# Altium schematic sheet 24D_USonicEcho_test.SchDoc
size A4
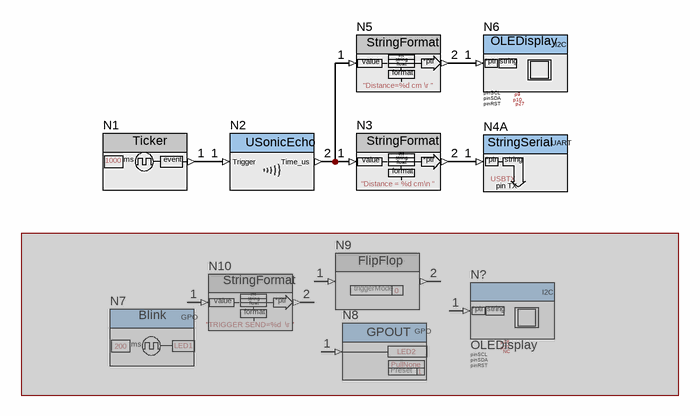
[diagram p0: 24D_USonicEcho_test.SchDoc]

## Parts
N1  Ticker  nBlocksParameter1: 1000
N2  USonicEcho
N3  StringFormat  nBlocksParameter1: "Distance = %d cm\n "
N4  StringSerial  nBlocksParameter1: USBTX  (part A of 2)
N5  StringFormat  nBlocksParameter1: "Distance=%d cm \r "
N6  OLEDisplay  Parameter 2: pinSCL  Parameter 1: pinSDA  Parameter 3: pinRST  nBlocksParameter3: p27  nBlocksParameter2: p10  nBlocksParameter1: p9
N7  Blink  nBlocksParameter2: LED1  nBlocksParameter1: 200  (masked out: inside a compile mask, not in the netlist)
N8  GPOUT  nBlocksParameter1: LED2  Parameter 3: Preset  nBlocksParameter3: 1  nBlocksParameter2: PullNone  (masked out: inside a compile mask, not in the netlist)
N9  FlipFlop  Parameter 1: triggerMode  nBlocksParameter1: 0  (masked out: inside a compile mask, not in the netlist)
N10  StringFormat  nBlocksParameter1: "TRIGGER SEND=%d  \r "  (masked out: inside a compile mask, not in the netlist)
N?  OLEDisplay  Parameter 2: pinSCL  Parameter 1: pinSDA  Parameter 3: pinRST  nBlocksParameter3: NC  nBlocksParameter2: p27  nBlocksParameter1: p28  (masked out: inside a compile mask, not in the netlist)

## Nets
NetN1_1: N1.1(OUT) N2.1(Trigger)
NetN2_2: N2.2(Time_us) N3.1(IN) N5.1(IN)
NetN3_2: N3.2(OUT) N4.1(TX)
NetN5_2: N5.2(OUT) N6.1(value)

## Notes on the sheet
- (in symbol NODE-BLINK) GPO; ms
- (in symbol NODE-GPOUT) GPO
- (in symbol NODE-OLEDisplay) I2C; *ptr; string
- (in symbol NODE-STRINGFORMAT) int; string; value; float; *ptr; format
- (in symbol NODE-STRINGSERIAL-split, part A) UART; *ptr; string; pin TX
- (in symbol NODE-TICKER) ms; event

## Library data of the parts
N1 = NODE-TICKER: Creates a Periodical Event; ComponentLink1Description: link; ComponentLink1URL: https://github.com/nBlocksStudioNodes/nblocks_ticker
N2 = NODE-USonicEcho: # USonicEcho / Ultrasonic distance sensor Node for the Parallax Ping / *  Category: Sensor / *  HAL: mbed / *  Tested: with LPC1768 / *  Author: N. Chalikias / ## Output data types / *  uint32_t: Echo time in micro-seconds for coefficient =1, or divided by the coefficient parameter / ## Inputs / Outputs / *  (Schematic pin 2) uint32_t: Echo time in micro-seconds / *  (Schematic pin 1) Trigger Input / ## Parameters: / *  PinName: EchoPin: Pin to be used for the signal from/to the board / *  uint32_t: coefficient: Value to divide the 2 ways echo time measured: / * 1 for raw 2 ways travel value in us / * 2 for one way travel in us / * 58 for one way in centimeters / * Any other value that suits a use case / ## Example: / [Ticker]-->[USonicEcho]-->[StringFormat]-->[StringSerial]; Parameter 1: pinEcho; nBlocksParameter1: p17; nBlocksParameter2: 58; ComponentLink1Description: link; ComponentLink1URL: https://github.com/nBlocksStudioNodes/nblocks_usonicecho; Parameter 2: coefficient
N3 N5 N10 = NODE-STRINGFORMAT: # StringFormat / Adds Formatting to a number in printf style / *  Category: String / *  HAL: mbed / *  Tested: LPC1768, STM32F103, STM32F401, nRF52832 / *  Author: Fernando Cosentino / ## Inputs/Outputs / *  (1) Input int: Value in form of string, or int or float / *  (2) Output uint32_t: Pointer to array of string, or int, or float / ## Parameters / *  formatString: example "Value: %d\n" / ## Example: / [Ticker][Counter][StringFormat][StringSerial] / Prints / “Value: 0” / “Value: 1” / “Value: 3” / …; ComponentLink1Description: link; ComponentLink1URL: https://github.com/nBlocksStudioNodes/nblocks_stringformat; Parameter 1: formatString
N4 = NODE-STRINGSERIAL-split: StringSerial / This node implements a serial port, where characters received from the external world (RX pin) are sent one by one to the node's output, but the node's input expects a full string object as input (sent entirely within one frame to the TX pin). / DO NOT CONNECT integer data into this node, as it will definitely lead to incorrect behaviour, sending random bytes in unpredicted amount to the serial port. This can be harmful depending on your design.; nBlocksParameter2: USBRX; Parameter 2: pinRX; Parameter 1: pinTX; ComponentLink1Description: link; ComponentLink1URL: https://github.com/nBlocksStudioNodes/nblocks_stringserial
N6 N? = NODE-OLEDisplay: # LM75 / This node handles temperature readings from a LM75 sensor over I2C. / *  Category: Sensor / *  HAL: mbed / *  Tested: LPC1768 / *  Author: Fernando Cosentino / ## Inputs/Outputs / *  (1) Trigger: Starts a measurement conversion / *  (2) Celcius:  °C  Temperature in degrees Celcius / ## Parameters / *  PinName: Pin connected to the sensor's SDA line / *  PinName: Pin connected to the sensor's SCL line / *  int: I2C address / *  float: alarmMin, Lower threshold for temperature alarm / *  float: alarmMax, Upper threshold for temperature alarm / *  int: comparatorPolarity, output value for the OS output when active / *  int: scale: Scale Factor / *  Multiplier for temperature value as integer (scale=100 means 2.5C will be represented as 250) / ## Example: / [Ticker]-->[LM75]-->[StringFormat]-->[StringSerial]; ComponentLink1Description: link; ComponentLink1URL: https://github.com/nBlocksStudioNodes/nblocks_oledisplay
N7 = NODE-BLINK: # Blink / The purpose of this node in a Diagram is to Blink an LED.You only need Blink node to create a working Blink program (...or embedded board Hello World). / Can be used for LED blinking or GPO pulsing. / It is a configuration Node, does not need any connection. / *  Category: Configuration / *  HAL: mbed / *  Tested: LPC1768, LPC11U35, STM32F103, STM32F401, nRF52832 / *  Author: N. Chalikias / ## Parameters / *  uint32_t: period in ms / *  PinName: pinOut / Example: / [Blink]; Parameter 1: period(ms); ComponentLink1Description: link; ComponentLink1URL: https://github.com/nBlocksStudioNodes/nblocks_blink; Parameter 2: pinOut
N8 = NODE-GPOUT: General Purpose Mcroprocessor Output, set modeString as: PullUp, PullDown, PullNone, OpenDrain; Parameter 1: pinOut; ComponentLink1Description: link; ComponentLink1URL: https://github.com/nBlocksStudioNodes/nblocks_gpout; Parameter 2: modeString
N9 = NODE-FLIPFLOP: [0] for (triggerMode_Positive) when the received value is > 0,        [1] for ( triggerMode_Zero), will toggle when received value = 0,  [2] for ( triggerMode_Both) it will toggle on any value; ComponentLink1Description: link; ComponentLink1URL: https://github.com/nBlocksStudioNodes/nblocks_flipflop